# Altium schematic sheet 5-Btn and beeper.SchDoc
size A4
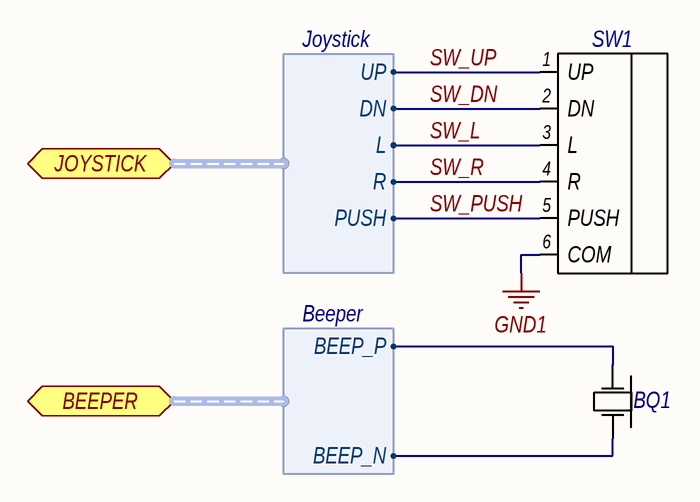
[diagram p0: 5-Btn and beeper.SchDoc]

## Parts
BQ1  TFM-25B  [CST-931RP-A]  (value not drawn)
SW1  Joystick  [jOYSTICK_sam]  (value not drawn)

## Ports
BEEPER (harness Beeper), JOYSTICK (harness Joystick)

## Harnesses
Joystick: UP, DN, L, R, PUSH
Beeper: BEEP_P, BEEP_N

## Nets
GND1: SW1.6(COM)
SW_DN: SW1.2(DN) ; port JOYSTICK.DN
SW_L: SW1.3(L) ; port JOYSTICK.L
SW_PUSH: SW1.5(PUSH) ; port JOYSTICK.PUSH
SW_R: SW1.4(R) ; port JOYSTICK.R
SW_UP: SW1.1(UP) ; port JOYSTICK.UP
NetBQ1_1: BQ1.1 ; port BEEPER.BEEP_P
NetBQ1_2: BQ1.2 ; port BEEPER.BEEP_N

## Library data of the parts
BQ1 = Пьезоизлучатель TFM-25B: PartNumber: CST-931RP-A
SW1 = Joystick: Joystick, 4-dir+push; PartNumber: Custom